# EAGLE design shifter-4rgb (EAGLE 6.4)
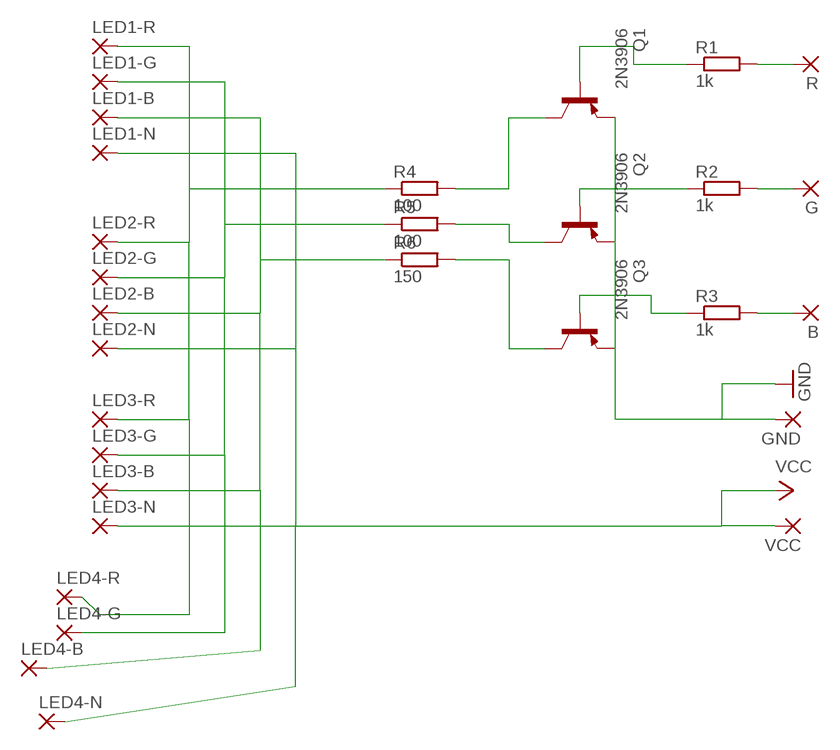
[diagram p0: schematic, sheet 1]

## Parts
B  2,54/0,8  [2,54/0,8]
G  2,54/0,8  [2,54/0,8]
GND  2,54/0,8  [2,54/0,8]
LED1-B  2,54/0,8  [2,54/0,8]
LED1-G  2,54/0,8  [2,54/0,8]
LED1-N  2,54/0,8  [2,54/0,8]
LED1-R  2,54/0,8  [2,54/0,8]
LED2-B  2,54/0,8  [2,54/0,8]
LED2-G  2,54/0,8  [2,54/0,8]
LED2-N  2,54/0,8  [2,54/0,8]
LED2-R  2,54/0,8  [2,54/0,8]
LED3-B  2,54/0,8  [2,54/0,8]
LED3-G  2,54/0,8  [2,54/0,8]
LED3-N  2,54/0,8  [2,54/0,8]
LED3-R  2,54/0,8  [2,54/0,8]
LED4-B  2,54/0,8  [2,54/0,8]
LED4-G  2,54/0,8  [2,54/0,8]
LED4-N  2,54/0,8  [2,54/0,8]
LED4-R  2,54/0,8  [2,54/0,8]
Q1  2N3906  [TO92]
Q2  2N3906  [TO92]
Q3  2N3906  [TO92]
R  2,54/0,8  [2,54/0,8]
R1  1k  R-EU_0207/2V  [0207/2V]
R2  1k  R-EU_0207/2V  [0207/2V]
R3  1k  R-EU_0207/2V  [0207/2V]
R4  100  R-EU_0207/2V  [0207/2V]
R5  100  R-EU_0207/7  [0207/7]
R6  150  R-EU_0207/2V  [0207/2V]
VCC  2,54/0,8  [2,54/0,8]

## Nets
GND: GND.1(P) Q1.3(E) Q2.3(E) Q3.3(E)
N$1: LED1-R.1(P) LED2-R.1(P) LED3-R.1(P) LED4-R.1(P) R4.1
N$2: LED1-G.1(P) LED2-G.1(P) LED3-G.1(P) LED4-G.1(P) R5.1
N$3: LED1-B.1(P) LED2-B.1(P) LED3-B.1(P) LED4-B.1(P) R6.1
N$4: Q1.1(C) R4.2
N$5: Q2.1(C) R5.2
N$6: Q3.1(C) R6.2
N$7: Q1.2(B) R1.1
N$8: R1.2 R.1(P)
N$9: G.1(P) R2.2
N$10: B.1(P) R3.2
N$11: Q2.2(B) R2.1
N$12: Q3.2(B) R3.1
VCC: LED1-N.1(P) LED2-N.1(P) LED3-N.1(P) LED4-N.1(P) VCC.1(P)

## Library data of the parts
B G GND LED1-B LED1-G LED1-N LED1-R LED2-B LED2-G LED2-N LED2-R LED3-B LED3-G LED3-N LED3-R LED4-B LED4-G LED4-N LED4-R R VCC = wirepad:2,54/0,8: THROUGH-HOLE PAD
Q1-Q3 = transistor-pnp:2N3906: PNP Transistor
R1-R6 = rcl:R-EU_: RESISTOR, European symbol

## Net classes
0 default: clearance 0.355 mm

## Board
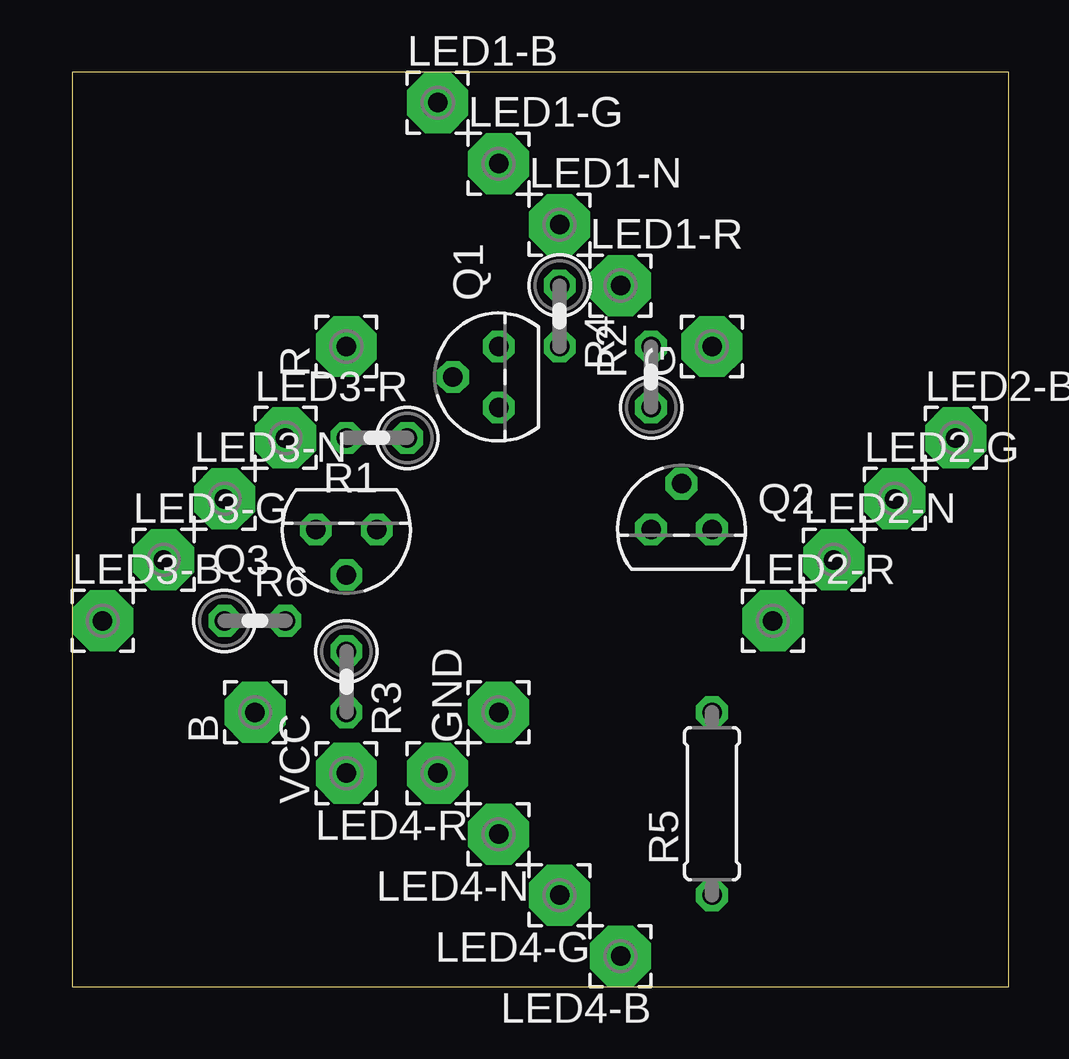
[diagram p1: board, top side]
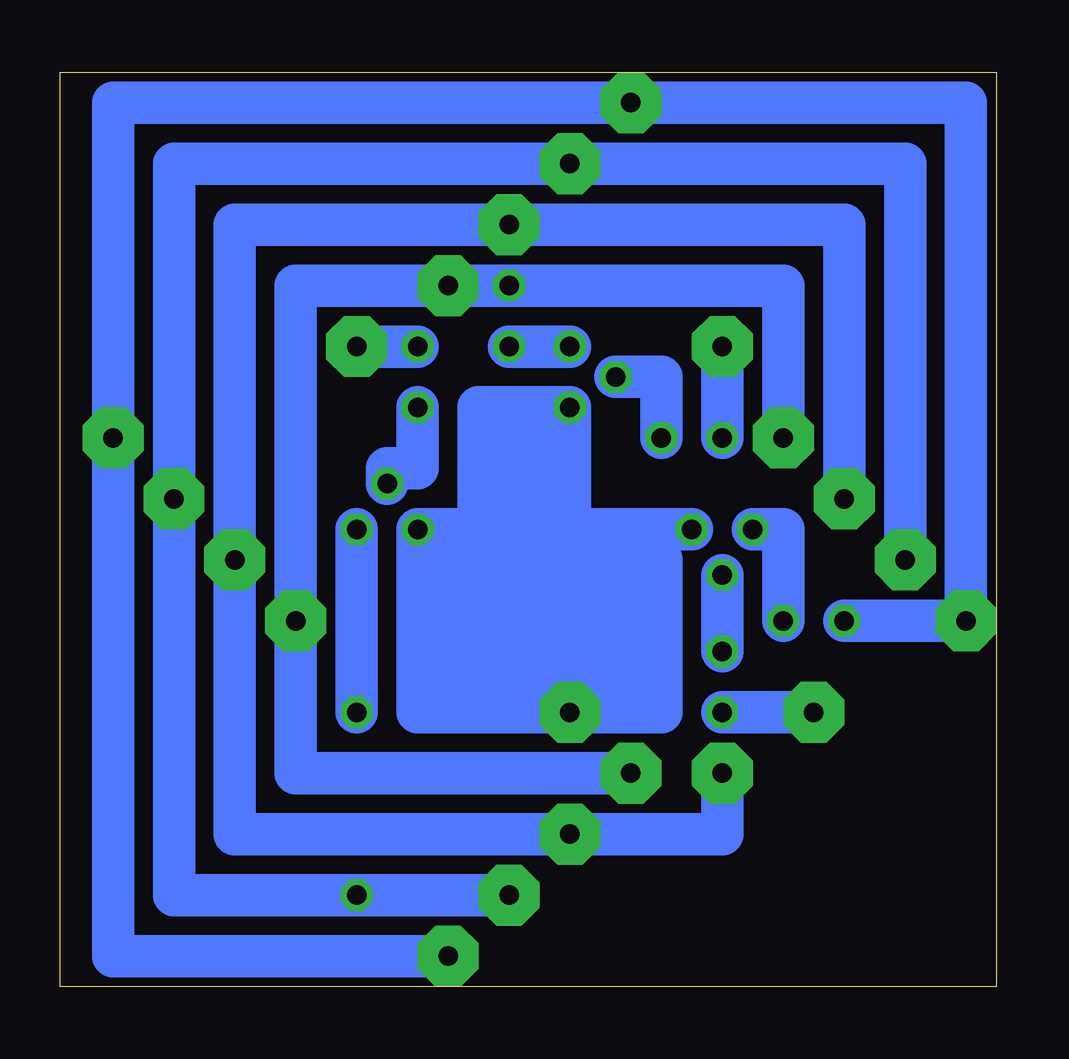
[diagram p2: board, bottom side, seen from below]

Size 39.04 x 38.09 mm. Coordinates in mm from the lower left corner, seen from the top.
Outline: 0,0 39.04,0 39.04,38.09 0,38.09 0,0
Copper layers (1*16): Top 0.035mm / dielectric 1.5mm / Bottom 0.035mm
Design rules "default": minimum track width 10mil, minimum drill 24mil, track to track 8mil, track to pad 8mil, pad to pad 8mil, via to via 8mil, smd to smd 8mil, copper to edge 40mil, drill to drill 8mil, minimum pad ring 10mil, minimum via ring 8mil, stop-mask expansion 4mil, vias tented up to drill 0mil, thermal gap 10mil

### Footprints (pad centres in the part's own frame; a part is rotated, then mirrored left to right if it is on the bottom)
2,54/0,8 = drill 0.813 pad 2.54 octagon: 1 0,0
TO92 = drill 0.813 octagon: 1 1.27,0; 2 0,1.905; 3 -1.27,0
0207/2V = drill 0.813 octagon: 1 -1.27,0; 2 1.27,0
0207/7 = drill 0.813 octagon: 1 -3.81,0; 2 3.81,0

### Placement (x,y rotation side)
B  7.62,11.43 90 top
G  26.67,26.67 90 top
GND  17.78,11.43 90 top
LED1-B  15.24,36.83 0 top
LED1-G  17.78,34.29 0 top
LED1-N  20.32,31.75 0 top
LED1-R  22.86,29.21 0 top
LED2-B  36.83,22.86 0 top
LED2-G  34.29,20.32 0 top
LED2-N  31.75,17.78 0 top
LED2-R  29.21,15.24 0 top
LED3-B  1.27,15.24 0 top
LED3-G  3.81,17.78 0 top
LED3-N  6.35,20.32 0 top
LED3-R  8.89,22.86 0 top
LED4-B  22.86,1.27 180 top
LED4-G  20.32,3.81 180 top
LED4-N  17.78,6.35 180 top
LED4-R  15.24,8.89 180 top
Q1  17.78,25.4 90 top
Q2  25.4,19.05 0 top
Q3  11.43,19.05 180 top
R  11.43,26.67 90 top
R1  12.7,22.86 180 top
R2  24.13,25.4 90 top
R3  11.43,12.7 270 top
R4  20.32,27.94 270 top
R5  26.67,7.62 90 top
R6  7.62,15.24 0 top
VCC  11.43,8.89 90 top

### Tracks (layer width: path | path; a pad name or v marks a point on that pad's centre or on a via)
GND
  Bottom 1.778: Q3.3 17.78,19.05 | 17.78,19.05 Q1.3 | GND.1 24.13,11.43 Q2.3 22.86,19.05 | 21.59,19.05 17.78,19.05 | 19.05,24.13 Q1.3 | Q1.3 21.59,24.13 21.59,21.59 20.32,21.59 20.32,20.32 | 20.32,20.32 21.59,20.32 | 20.32,20.32 19.05,20.32 19.05,22.86 21.59,22.86 21.59,19.05 | 21.59,19.05 22.86,19.05 | 22.86,19.05 22.86,12.7 13.97,12.7 | 13.97,12.7 13.97,13.97 13.97,17.78 21.59,17.78 21.59,13.97 15.24,13.97 15.24,16.51 16.51,16.51 16.51,15.24 20.32,15.24 20.32,16.51 17.78,16.51 GND.1 | GND.1 13.97,11.43 13.97,12.7
N$1
  Bottom 1.778: LED3-R.1 8.89,29.21 R4.1 LED1-R.1 29.21,29.21 LED2-R.1 29.21,8.89 LED4-R.1
N$2
  Bottom 1.778: LED3-G.1 3.81,34.29 LED1-G.1 34.29,34.29 LED2-G.1 34.29,3.81 R5.1 LED4-G.1
N$3
  Bottom 1.778: R6.1 LED3-B.1 1.27,36.83 LED1-B.1 36.83,36.83 LED2-B.1 36.83,1.27 LED4-B.1
N$4
  Bottom 1.778: Q1.1 R4.2
N$5
  Bottom 1.778: Q2.1 R5.2
N$6
  Bottom 1.778: Q3.1 8.89,19.05 R6.2
N$7
  Bottom 1.778: R1.1 13.97,25.4 Q1.2
N$8
  Bottom 1.778: R.1 R1.2
N$9
  Bottom 1.778: R2.2 G.1
N$10
  Bottom 1.778: B.1 R3.2
N$11
  Bottom 1.778: R2.1 24.13,21.59 25.4,21.59 Q2.2
N$12
  Bottom 1.778: R3.1 Q3.2
VCC
  Bottom 1.778: LED3-N.1 6.35,31.75 LED1-N.1 31.75,31.75 LED2-N.1 31.75,6.35 LED4-N.1 15.24,6.35 13.97,6.35 11.43,6.35 VCC.1